# Altium schematic sheet Battey_Voltage.SchDoc
size A4; SheetNumber: 3; SheetTotal: 9
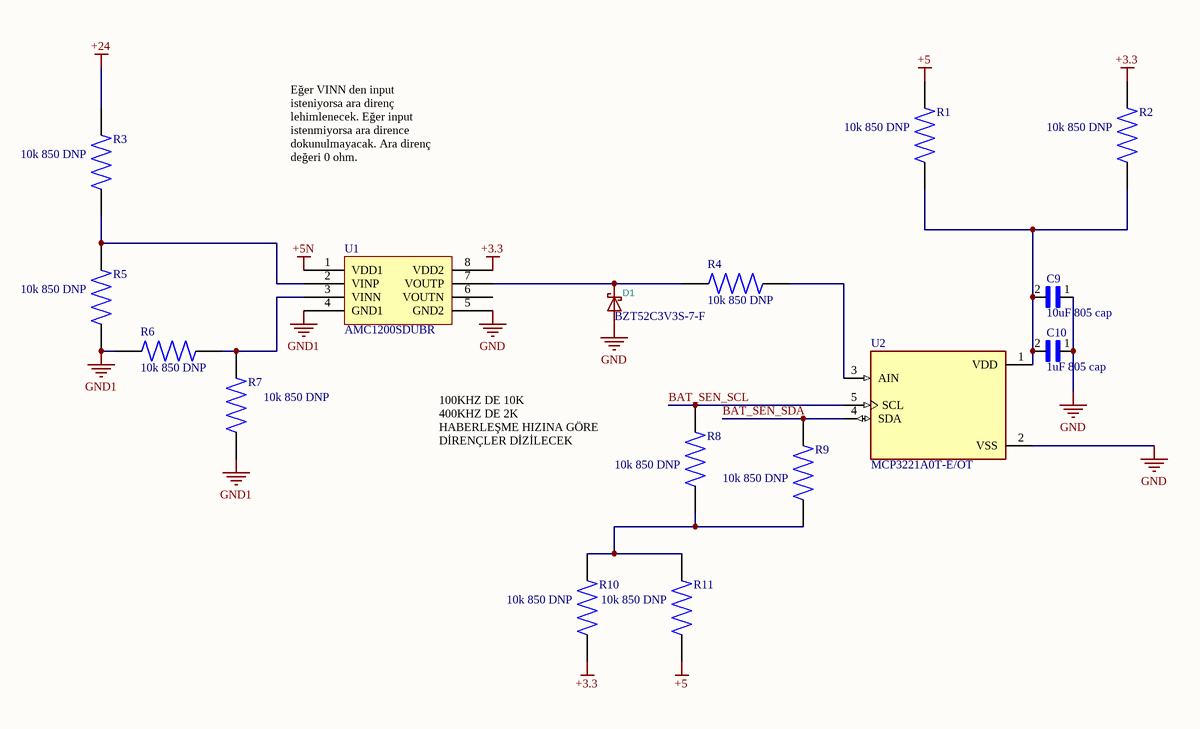
[diagram p0: Battey_Voltage.SchDoc]

## Parts
C9  10uF 805 cap  [1uF 805 Cap]
C10  1uF 805 cap  [1uF 805 Cap]
D1  BZT52C3V3S-7-F  [SOD2513X120N]
R1  10k 850 DNP  [10k 850]
R2  10k 850 DNP  [10k 850]
R3  10k 850 DNP  [10k 850]
R4  10k 850 DNP  [10k 850]
R5  10k 850 DNP  [10k 850]
R6  10k 850 DNP  [10k 850]
R7  10k 850 DNP  [10k 850]
R8  10k 850 DNP  [10k 850]
R9  10k 850 DNP  [10k 850]
R10  10k 850 DNP  [10k 850]
R11  10k 850 DNP  [10k 850]
U1  AMC1200SDUBR  [SOP254P1040X485-8N]
U2  MCP3221A0T-E/OT  [SOT95P280X145-5N]

## Nets
+3.3: R2.1 R10.2 U1.8(VDD2)
+5: R1.1 R11.2
+5N: U1.1(VDD1)
+24: R3.1
GND: C9.1 C10.1 D1.A U1.5(GND2) U2.2(VSS)
GND1: R5.2 R6.2 R7.1 U1.4(GND1)
BAT_SEN_SCL: R8.2 U2.5(SCL)
BAT_SEN_SDA: R9.2 U2.4(SDA)
NetC9_2: C9.2 C10.2 R1.2 R2.2 U2.1(VDD)
NetD1_K: D1.K R4.1 U1.7(VOUTP)
NetR3_2: R3.2 R5.1 U1.2(VINP)
NetR4_2: R4.2 U2.3(AIN)
NetR6_1: R6.1 R7.2 U1.3(VINN)
NetR8_1: R8.1 R9.1 R10.1 R11.1

Not connected (* = marked no-connect by the designer): U1 6(VOUTN)

## Notes on the sheet
- Eğer VINN den input isteniyorsa ara direnç lehimlenecek. Eğer input istenmiyorsa ara dirence dokunulmayacak. Ara direnç değeri 0 ohm.
- 100KHZ DE 10K
  400KHZ DE 2K
  HABERLEŞME HIZINA GÖRE DİRENÇLER DİZİLECEK

## Library data of the parts
C9 = 1uF 805 cap
D1 = BZT52C3V3S-7-F: ki_keywords: Schottky; ki_description: Schottky Diode; Datasheet: https://diotec.com/de/produktliste/SBD.html
R1-R11 = 10k 850
U2 = MCP3221A0T-E/OT: 12-bit ADC, I2C, single channel5 SOT-23 T/R | Microchip Technology Inc. MCP3221A0T-E/OT; SnapEDA_Link: https://www.snapeda.com/parts/MCP3221A0T-E/OT/Microchip/view-part/?ref=snap; Package: SOT-23 Microchip; Value: *; MF: Microchip Technology; MP: MCP3221A0T-E/OT; Check_prices: https://www.snapeda.com/parts/MCP3221A0T-E/OT/Microchip/view-part/?ref=eda